# EAGLE design Wago Testadapter 1 (EAGLE 6.5.0)
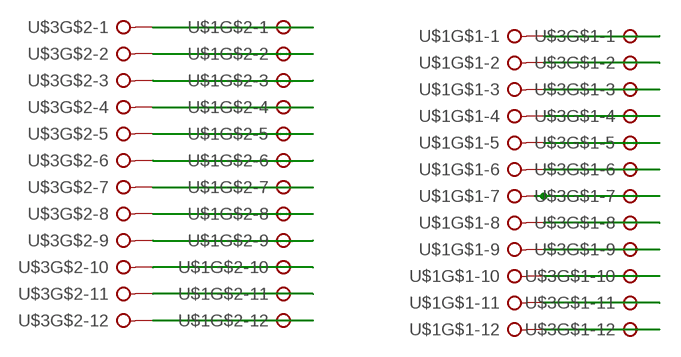
[diagram p0: schematic, sheet 1]

## Parts
U$1  TESTADAPTER-24P  [24-PIN-TESTADAPTER]
U$3  TESTADAPTER-24P24-PIN-ANSCHLUSS  [24-PIN-ANSCHLUSS]

## Nets
N$1: U$1.P$2-1 U$3.P$2-1
N$2: U$1.P$2-2 U$3.P$2-2
N$3: U$1.P$2-3 U$3.P$2-3
N$4: U$1.P$2-4 U$3.P$2-4
N$5: U$1.P$2-5 U$3.P$2-5
N$6: U$1.P$2-6 U$3.P$2-6
N$7: U$1.P$2-7 U$3.P$2-7
N$8: U$1.P$2-8 U$3.P$2-8
N$9: U$1.P$2-9 U$3.P$2-9
N$10: U$1.P$2-10 U$3.P$2-10
N$11: U$1.P$2-11 U$3.P$2-11
N$12: U$1.P$2-12 U$3.P$2-12
N$13: U$1.P$1-5 U$3.P$1-5
N$14: U$1.P$1-2 U$3.P$1-2
N$15: U$1.P$1-3 U$3.P$1-3
N$16: U$1.P$1-4 U$3.P$1-4
N$17: U$1.P$1-1 U$3.P$1-1
N$18: U$1.P$1-6 U$3.P$1-6
N$19: U$1.P$1-7 U$3.P$1-7
N$20: U$1.P$1-8 U$3.P$1-8
N$21: U$1.P$1-9 U$3.P$1-9
N$22: U$1.P$1-10 U$3.P$1-10
N$23: U$1.P$1-11 U$3.P$1-11
N$24: U$1.P$1-12 U$3.P$1-12

## Library data of the parts
U$1 U$3 = con WAGO BMW:TESTADAPTER-24P: Testadapter mit Pogo Pins um Kontakt mit Wago Leiste herzustellen

## Board
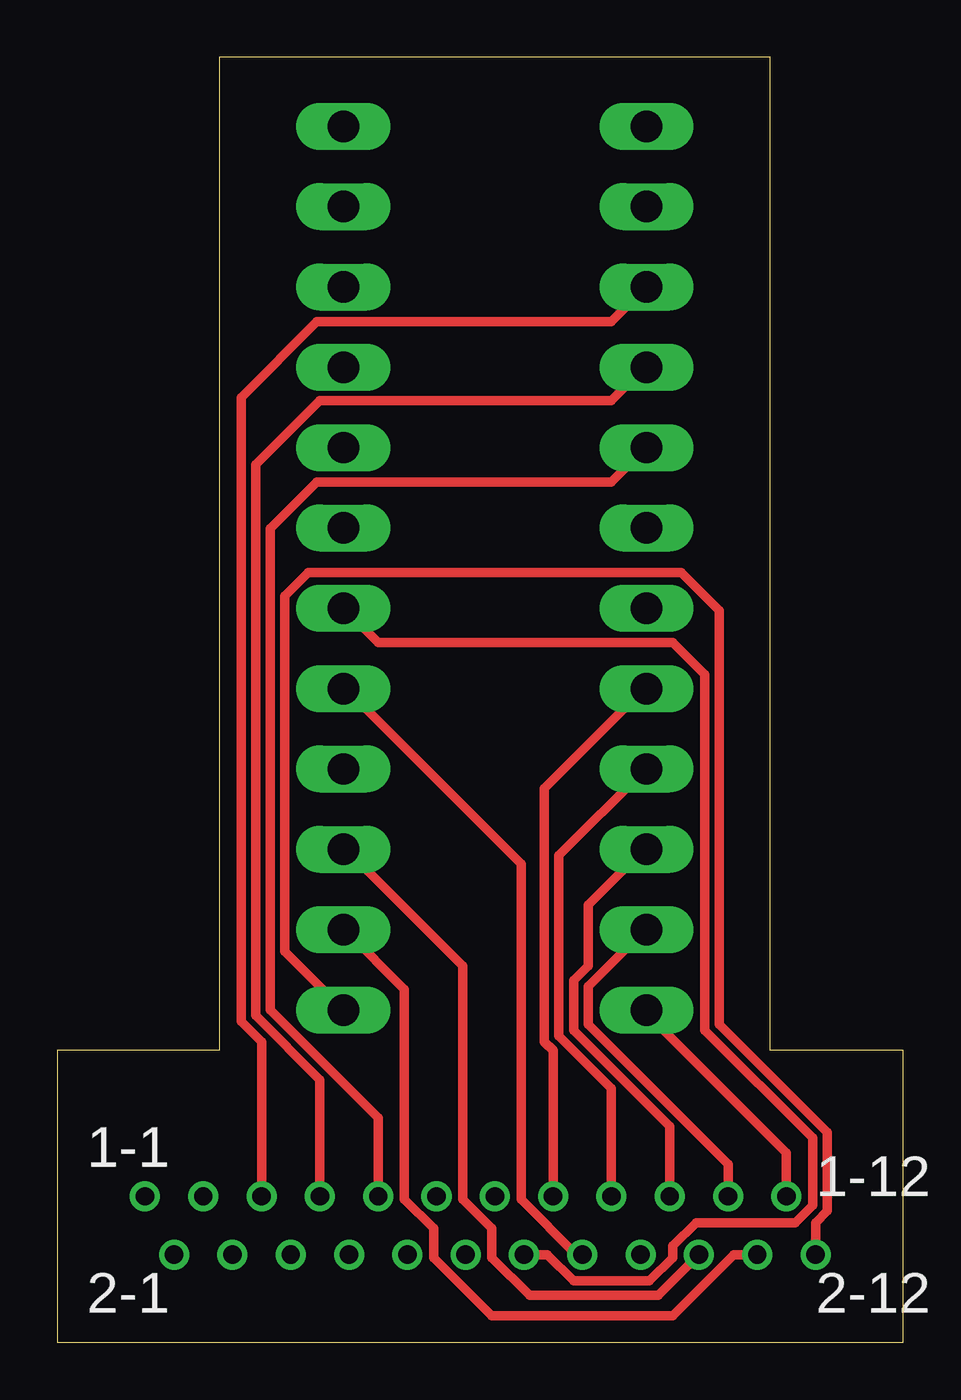
[diagram p1: board, top side]
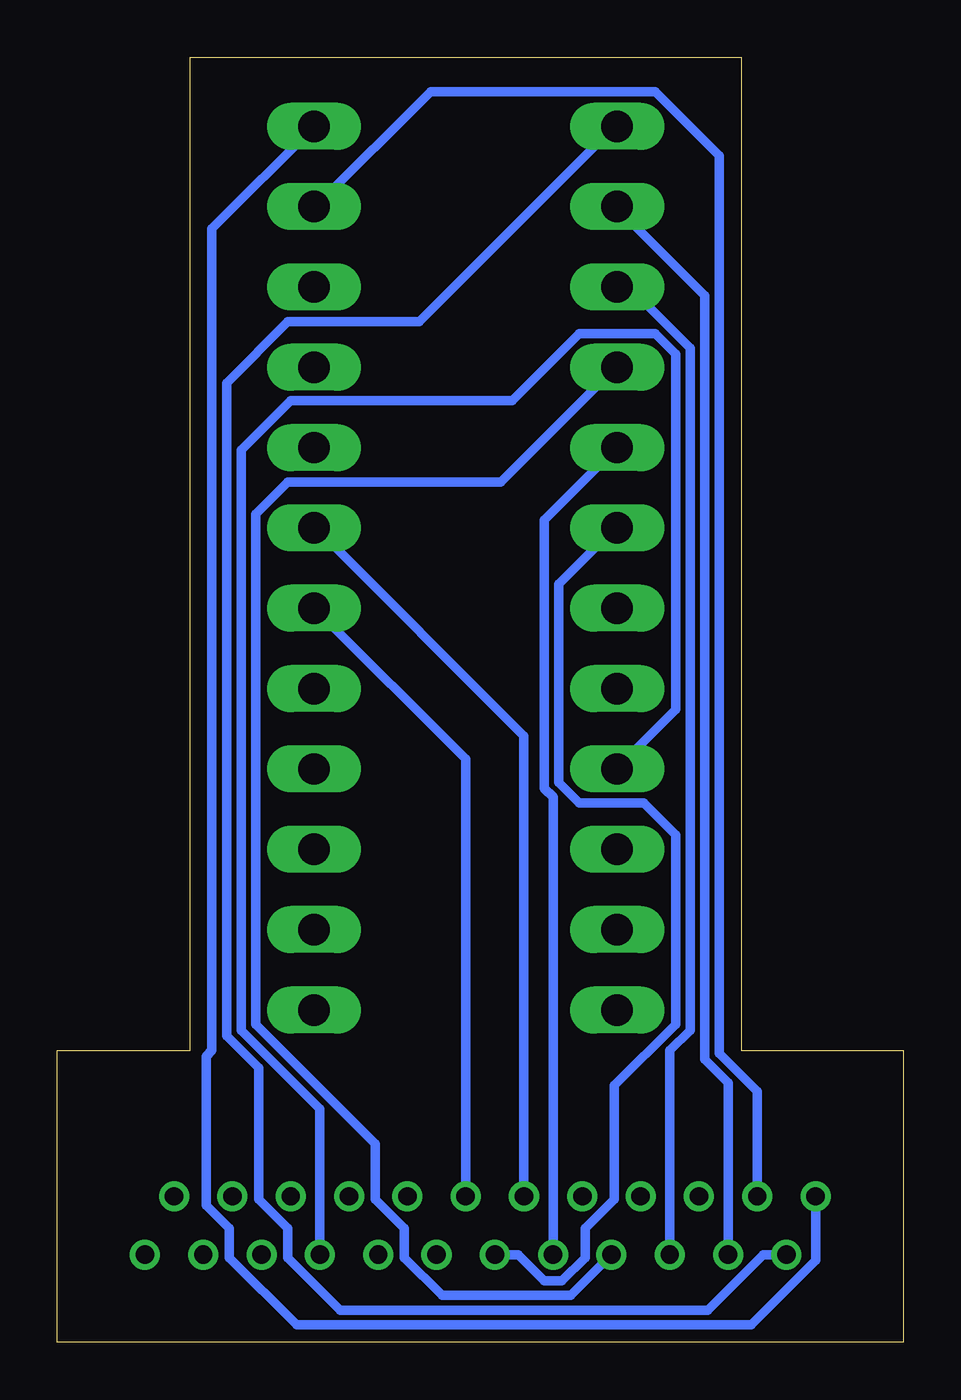
[diagram p2: board, bottom side, seen from below]

Size 36.83 x 55.97 mm. Coordinates in mm from the lower left corner, seen from the top.
Outline: 31.05,12.7 31.05,55.97 7.05,55.97 7.05,12.7 0,12.7 0,0 36.83,0 36.83,12.7 31.05,12.7
Copper layers (1*16): Top 0.035mm / dielectric 1.5mm / Bottom 0.035mm
Design rules "default *": minimum track width 16mil, minimum drill 24mil, track to track 8mil, track to pad 8mil, pad to pad 8mil, via to via 12mil, smd to smd 8mil, copper to edge 20mil, drill to drill 12mil, minimum pad ring 10mil, minimum via ring 8mil, stop-mask expansion 4mil, vias tented up to drill 0mil, thermal gap 10mil

### Footprints (pad centres in the part's own frame; a part is rotated, then mirrored left to right if it is on the bottom)
24-PIN-TESTADAPTER = drill 1.37 long: P$1-1 6.6,19.25; P$1-2 6.6,15.75; P$1-3 6.6,12.25; P$1-4 6.6,8.75; P$1-5 6.6,5.25; P$1-6 6.6,1.75; P$1-7 6.6,-1.75; P$1-8 6.6,-5.25; P$1-9 6.6,-8.75; P$1-10 6.6,-12.25; P$1-11 6.6,-15.75; P$1-12 6.6,-19.25; P$2-1 -6.6,19.25; P$2-2 -6.6,15.75; P$2-3 -6.6,12.25; P$2-4 -6.6,8.75; P$2-5 -6.6,5.25; P$2-6 -6.6,1.75; P$2-7 -6.6,-1.75; P$2-8 -6.6,-5.25; P$2-9 -6.6,-8.75; P$2-10 -6.6,-12.25; P$2-11 -6.6,-15.75; P$2-12 -6.6,-19.25
24-PIN-ANSCHLUSS = drill 0.8: P$1-1 0,0; P$1-2 2.54,0; P$1-3 5.08,0; P$1-4 7.62,0; P$1-5 10.16,0; P$1-6 12.7,0; P$1-7 15.24,0; P$1-8 17.78,0; P$1-9 20.32,0; P$1-10 22.86,0; P$1-11 25.4,0; P$1-12 27.94,0; P$2-1 1.27,-2.54; P$2-2 3.81,-2.54; P$2-3 6.35,-2.54; P$2-4 8.89,-2.54; P$2-5 11.43,-2.54; P$2-6 13.97,-2.54; P$2-7 16.51,-2.54; P$2-8 19.05,-2.54; P$2-9 21.59,-2.54; P$2-10 24.13,-2.54; P$2-11 26.67,-2.54; P$2-12 29.21,-2.54

### Placement (x,y rotation side)
U$1  19.05,33.72 0 top
U$3  3.81,6.35 0 top

### Tracks (layer width: path | path; a pad name or v marks a point on that pad's centre or on a via)
N$1
  Bottom 0.406: U$3.P$2-1 6.1,3.81 8.51,1.4 24.51,1.4 26.8,3.68 26.8,4.95 28.07,6.22 28.07,11.94 29.46,13.34 29.46,41.78 26.8,44.45 21.08,44.45 12.57,52.96 U$1.P$2-1
N$2
  Bottom 0.406: U$3.P$2-2 7.62,11.3 8.64,12.32 8.64,45.59 12.45,49.4 U$1.P$2-2
N$3
  Bottom 0.406: U$3.P$2-3 10.16,12.7 9.27,13.59 9.27,43.31 11.81,45.85 12.45,45.85 U$1.P$2-3
N$4
  Bottom 0.406: U$3.P$2-4 14.48,2.03 20.07,2.03 21.72,3.68 21.72,4.95 22.99,6.22 22.99,8.64 28.19,13.84 28.19,36.07 26.8,37.47 17.53,37.47 12.57,42.42 U$1.P$2-4
N$5
  Bottom 0.406: U$3.P$2-5 15.24,23.75 15.62,24.13 15.62,35.81 12.57,38.86 U$1.P$2-5
N$6
  Bottom 0.406: U$3.P$2-6 16.76,3.81 15.62,2.67 14.86,2.67 13.84,3.68 13.84,4.95 12.57,6.22 12.57,11.18 9.91,13.84 9.91,22.1 11.3,23.5 14.1,23.5 14.99,24.38 14.99,33.02 12.57,35.43 U$1.P$2-6
N$7
  Top 0.406: U$3.P$2-7 21.34,3.81 22.48,2.67 25.78,2.67 26.8,3.68 26.8,4.19 27.81,5.21 32.13,5.21 32.89,5.97 32.89,8.89 28.19,13.59 28.19,29.08 26.8,30.48 13.97,30.48 12.57,31.88 U$1.P$2-7
N$8
  Top 0.406: U$3.P$2-8 22.61,3.81 20.19,6.22 20.19,20.83 12.57,28.45 U$1.P$2-8
N$9
  Bottom 0.406: U$3.P$2-9 25.4,10.16 28.83,13.59 28.83,38.86 26.67,41.02 17.02,41.02 14.1,43.94 10.79,43.94 9.91,43.05 9.91,27.56 12.45,25.02 U$1.P$2-9
N$10
  Top 0.406: U$3.P$2-10 26.16,2.03 20.57,2.03 18.92,3.68 18.92,4.95 17.65,6.22 17.65,16.38 12.57,21.46 U$1.P$2-10
N$11
  Top 0.406: U$3.P$2-11 29.46,3.81 26.8,1.14 18.92,1.14 16.38,3.68 16.38,4.95 15.11,6.22 15.11,15.37 12.57,17.91 U$1.P$2-11
N$12
  Top 0.406: U$3.P$2-12 33.02,5.21 33.53,5.71 33.53,9.14 28.83,13.84 28.83,31.88 27.18,33.53 10.92,33.53 9.91,32.51 9.91,17.02 U$1.P$2-12
N$13
  Top 0.406: U$3.P$1-5 13.97,9.78 9.27,14.48 9.27,35.43 11.3,37.47 24.13,37.47 25.53,38.86 U$1.P$1-5
N$14
  Bottom 0.406: U$3.P$1-2 6.35,10.92 8,12.57 8,51.69 10.79,54.48 20.57,54.48 25.53,49.53 U$1.P$1-2
N$15
  Top 0.406: U$3.P$1-3 8.89,13.08 8,13.97 8,41.15 11.3,44.45 24.13,44.45 U$1.P$1-3
N$16
  Top 0.406: U$3.P$1-4 11.43,11.43 8.64,14.22 8.64,38.23 11.43,41.02 24.13,41.02 25.53,42.42 U$1.P$1-4
N$17
  Bottom 0.406: U$3.P$1-1 3.81,3.56 6.6,0.76 26.42,0.76 29.34,3.68 29.34,4.95 30.35,5.97 30.35,12.45 30.1,12.7 30.1,48.51 25.65,52.96 U$1.P$1-1
N$18
  Bottom 0.406: U$3.P$1-6 16.51,26.42 25.53,35.43 U$1.P$1-6
N$19
  Bottom 0.406: U$3.P$1-7 19.05,25.4 25.53,31.88 U$1.P$1-7
N$20
  Top 0.406: U$3.P$1-8 21.59,12.7 21.21,13.08 21.21,24.13 25.53,28.45 U$1.P$1-8
N$21
  Top 0.406: U$3.P$1-9 24.13,11.05 21.84,13.34 21.84,21.21 25.53,24.89 U$1.P$1-9
N$22
  Top 0.406: U$3.P$1-10 26.67,9.4 22.48,13.59 22.48,15.75 23.11,16.38 23.11,19.05 25.53,21.46 U$1.P$1-10
N$23
  Top 0.406: U$3.P$1-11 29.21,7.75 23.11,13.84 23.11,15.49 25.53,17.91 U$1.P$1-11
N$24
  Top 0.406: U$3.P$1-12 31.75,8.26 25.65,14.35 U$1.P$1-12